# EasyEDA Pro project 硬件部分大作业  大一  徐子涵 学号2025210236.epro, schematic Schematic1
Board Name: Board1; Create Date: 2025-12-03; Page Name: main; Project Name: my_first_ed_1; Schematic Name: Schematic1; Update Date: 2025-12-11; Company: 嘉立创EDA; Page Size: A3; Version: V1.0
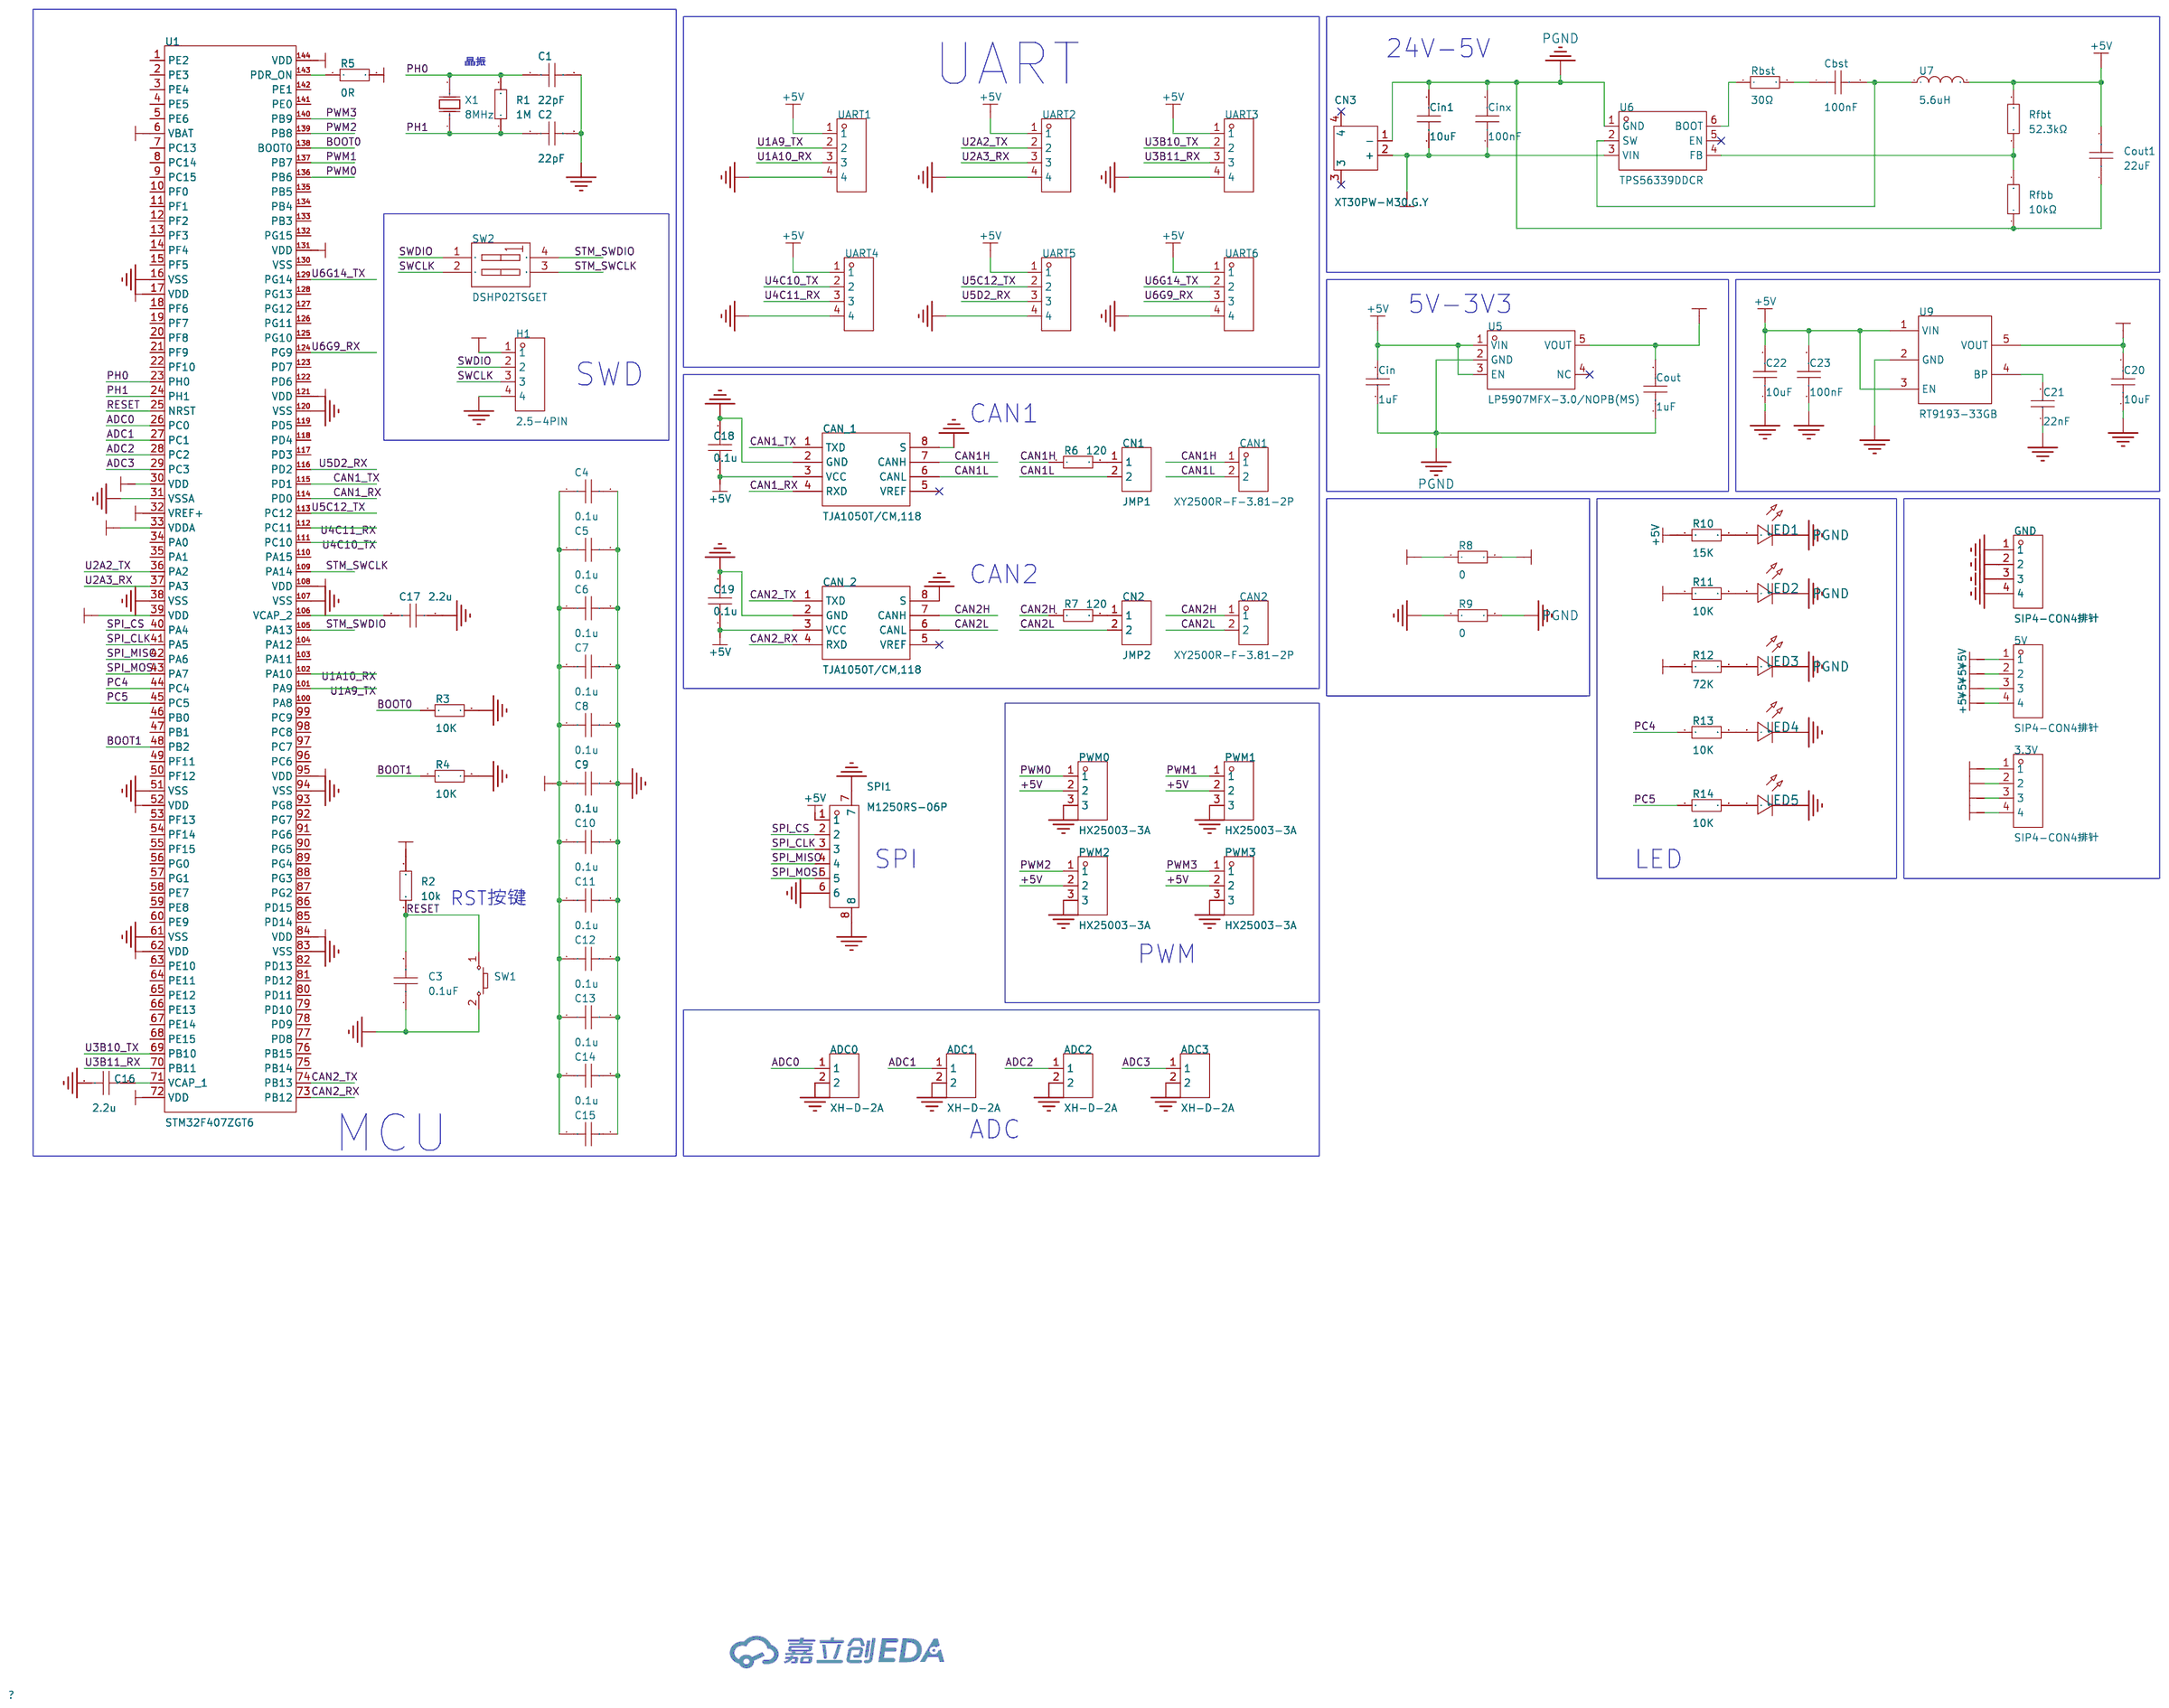
[diagram p0: schematic sheet]

## Parts
3.3V  SIP4-CON4排针  [HDR-TH_4P-P2.54-V-M-3]
5V  SIP4-CON4排针  [HDR-TH_4P-P2.54-V-M-3]
ADC0  XH-D-2A  [CONN-TH_XH-2A]
ADC1  XH-D-2A  [CONN-TH_XH-2A]
ADC2  XH-D-2A  [CONN-TH_XH-2A]
ADC3  XH-D-2A  [CONN-TH_XH-2A]
C1  22pF  [C0603]
C2  22pF  [C0603]
C3  0.1uF  [C0603]
C4  0.1u  [C0402]
C5  0.1u  [C0402]
C6  0.1u  [C0402]
C7  0.1u  [C0402]
C8  0.1u  [C0402]
C9  0.1u  [C0402]
C10  0.1u  [C0402]
C11  0.1u  [C0402]
C12  0.1u  [C0402]
C13  0.1u  [C0402]
C14  0.1u  [C0402]
C15  0.1u  [C0402]
C16  2.2u  [C0603]
C17  2.2u  [C0603]
C18  0.1u  [C0603]
C19  0.1u  [C0603]
C20  10uF  [C0603]
C21  22nF  [C0603]
C22  10uF  [C0603]
C23  100nF  [C0603]
CAN1  XY2500R-F-3.81-2P  [CONN-TH_XY2500R-F-3.81-2P]
CAN2  XY2500R-F-3.81-2P  [CONN-TH_XY2500R-F-3.81-2P]
CAN_1  TJA1050T/CM,118  [SOIC-8_L5.0-W4.0-P1.27-LS6.0-BL]
CAN_2  TJA1050T/CM,118  [SOIC-8_L5.0-W4.0-P1.27-LS6.0-BL]
Cbst  100nF  [C0805]
Cin  1uF  [C0603]
Cin1  10uF  [C0805]
Cinx  100nF  [C0805]
CN1  JMP1  [HDR-TH_2P-P2.54_C9900022687]
CN2  JMP2  [HDR-TH_2P-P2.54_C9900022687]
CN3  XT30PW-M30.G.Y  [CONN-TH_XT30PW-M]
Cout  1uF  [C0402]
Cout1  22uF  [C0805]
GND  SIP4-CON4排针  [HDR-TH_4P-P2.54-V-M-3]
H1  2.5-4PIN  [HDR-TH_4P-P2.54-V-M]
LED1  -  [LED_0603]
LED2  -  [LED_0603]
LED3  -  [LED_0603]
LED4  -  [LED_0603]
LED5  -  [LED_0603]
PWM0  HX25003-3A  [CONN-TH_3P-P2.50_HX25003-3A]
PWM1  HX25003-3A  [CONN-TH_3P-P2.50_HX25003-3A]
PWM2  HX25003-3A  [CONN-TH_3P-P2.50_HX25003-3A]
PWM3  HX25003-3A  [CONN-TH_3P-P2.50_HX25003-3A]
R1  1M  [R0603]
R2  10k  [R0603]
R3  10K  [R0603]
R4  10K  [R0603]
R5  0R  [R0603]
R6  120  [R0603]
R7  120  [R0603]
R8  0  [R0603]
R9  0  [R0603]
R10  15K  [R0603]
R11  10K  [R0603]
R12  72K  [R0603]
R13  10K  [R0603]
R14  10K  [R0603]
Rbst  30Ω  [R0603]
Rfbb  10kΩ  [R0603]
Rfbt  52.3kΩ  [R0603]
SPI1  M1250RS-06P  [CONN-SMD_M1250RS-06P]
SW1  -  [Key_SMD_3x4x2]
SW2  DSHP02TSGET  [SW-SMD_4P_DSHP02TSGET]
U1  STM32F407ZGT6  [LQFP-144_L20.0-W20.0-P0.50-LS22.0-BL]
U5  LP5907MFX-3.0/NOPB(MS)  [SOT-23-5_L2.9-W1.6-P0.95-LS2.8-BR]
U6  TPS56339DDCR  [TSOT-23-6_L2.9-W1.6-P0.95-LS2.8-BR]
U7  5.6uH  [IND-SMD_L13.0-W13.0-SDR1307-XXXXX]
U9  RT9193-33GB  [SOT-23-5_L3.0-W1.7-P0.95-LS2.8-BL]
UART1  SIP4-CON4排针  [HDR-TH_4P-P2.54-V-M-3]
UART2  SIP4-CON4排针  [HDR-TH_4P-P2.54-V-M-3]
UART3  SIP4-CON4排针  [HDR-TH_4P-P2.54-V-M-3]
UART4  SIP4-CON4排针  [HDR-TH_4P-P2.54-V-M-3]
UART5  SIP4-CON4排针  [HDR-TH_4P-P2.54-V-M-3]
UART6  SIP4-CON4排针  [HDR-TH_4P-P2.54-V-M-3]
X1  8MHz  [CRYSTAL-SMD_L5.0-W3.2]

## Library data of the parts
3.3V 5V GND UART1-UART6 = SIP4-CON4排针: Supplier Part: C9900002129; Supplier Footprint: SIP-4_2.54X10.16X2.54P; JLCPCB Part Class: 扩展库; Supplier: LCSC
ADC0-ADC3 = XH-D-2A: 插针结构:1x2P;间距:2.5mm;安装方式:直插;参考系列:XH;总PIN数:2P;排数:1;每排PIN数:2;行距:-;额定电流:3A;触头材质:-;触头镀层:-;工作温度:-25℃~+85℃;; LCSC Part Name: 1x2P 间距:2.5mm 直插 系列:XH; Supplier Part: C5160911; Manufacturer: DEALON(德艺隆); Supplier Footprint: 插件,P=2.5mm; JLCPCB Part Class: 扩展库; Datasheet: https://item.szlcsc.com/datasheet/XH-D-2A/5808077.html; Supplier: LCSC; Pins Structure: 1x2P; Pitch: 2.5mm; Mounting Type: 直插; Reference Series: XH; Number of Pins: 2P; Number of Rows: 1; Number of PINs Per Row: 2; Current Rating: 3A; Operating Temperature: -25℃~+85℃; Voltage Rating: 250V; Color: 白色; Z-Height of the Board: 7mm; X-Length of Bottom Edge on Board (Spacing Line): 7.5mm; Y-Width of Bottom Edge on Board: 5.8mm
C1-C3 C16-C19 = CAP_0603: Supplier Footprint: 0603; Sim Model: eb8db00cf755486a99d82f511adf71ce; Sim Model Title: Capacitor; Sim Model Path: 0819f05c4eef4c71ace90d822a990e87; NGSpice Model: b0400270a9e64a8faba05adf23a90584; NGSpice Model Title: Capacitor; NGspice Model Path: 0819f05c4eef4c71ace90d822a990e87
C4-C15 = CAP_0603: Supplier Footprint: 0402; Sim Model: eb8db00cf755486a99d82f511adf71ce; Sim Model Title: Capacitor; Sim Model Path: 0819f05c4eef4c71ace90d822a990e87; NGSpice Model: b0400270a9e64a8faba05adf23a90584; NGSpice Model Title: Capacitor; NGspice Model Path: 0819f05c4eef4c71ace90d822a990e87
C20 C22 = CGA0603X5R106K100JT: 容值:10uF;精度:±10%;额定电压:10V;温度系数:X5R;; LCSC Part Name: 10uF ±10% 10V; Supplier Part: C6119842; Manufacturer: HRE(芯声); Supplier Footprint: 0603; JLCPCB Part Class: 扩展库; Supplier: LCSC; Tolerance: ±10%; Voltage Rating: 10V; Temperature Coefficient: X5R
C21 = CL10B223KB8NNNC: 容值:22nF;精度:±10%;额定电压:50V;温度系数:X7R;; LCSC Part Name: 22nF ±10% 50V; Supplier Part: C21122; Manufacturer: SAMSUNG(三星); Supplier Footprint: 0603; JLCPCB Part Class: 基础库; Datasheet: https://item.szlcsc.com/datasheet/CL10B223KB8NNNC/21834.html; Supplier: LCSC; Tolerance: ±10%; Voltage Rating: 50V; Temperature Coefficient: X7R
C23 = CGA0603X7R104K500JT: 容值:100nF;精度:±10%;额定电压:50V;温度系数:X7R;; LCSC Part Name: 100nF ±10% 50V; Supplier Part: C6119867; Manufacturer: HRE(芯声); Supplier Footprint: 0603; JLCPCB Part Class: 扩展库; Datasheet: https://atta.szlcsc.com/upload/public/pdf/source/20250103/C44077DA9E7B3EFAE02F22B6D3D1CBC9.pdf; Supplier: LCSC; Tolerance: ±10%; Voltage Rating: 50V; Temperature Coefficient: X7R
CAN1 CAN2 = XY2500R-F-3.81-2P: 连接器类型:板端/插座-闭口;结构:1x2P;间距:3.81mm;颜色:绿色;安装方式:弯针;排数:1;每排PIN数:2;额定电流:8A;额定电压:300V;工作温度:-;; LCSC Part Name: 1x2P 3.81mm 排数:1 每排P数:2; Supplier Part: C880581; Manufacturer: XINLAIYA(新莱亚); Supplier Footprint: 弯插,P=3.81mm; JLCPCB Part Class: 扩展库; Datasheet: https://item.szlcsc.com/datasheet/XY2500R-F-3.81-2P/943405.html; Supplier: LCSC; Connector Type: 板端/插座-闭口; Number of Positions or Pins: 1x2P; Pitch: 3.81mm; Color: 绿色; Mounting Type: 弯针; Number of Pins: 2P; Number of Rows: 1; Number of PINs Per Row: 2; Current Rating: 8A; Voltage Rating (Max): 300V
CAN_1 CAN_2 = TJA1050T/CM,118: 类型:-;; LCSC Part Name: 4.75V~5.25V; Supplier Part: C6952; Manufacturer: NXP(恩智浦); Supplier Footprint: SOP-8; JLCPCB Part Class: 扩展库; Datasheet: https://www.nxp.com/docs/en/data-sheet/TJA1050.pdf; Supplier: LCSC; Supply Voltage: 4.75V~5.25V; Supply Current: 50mA
Cbst Cinx = C0805C104M5RACTU: 容值:100nF;精度:±20%;额定电压:50V;材质(温度系数):X7R;; LCSC Part Name: 100nF ±20% 50V; Supplier Part: C2167099; Manufacturer: KEMET(基美); Supplier Footprint: 0805; JLCPCB Part Class: 扩展库; Datasheet: https://atta.szlcsc.com/upload/public/pdf/source/20210401/FA43491E9CEFD02B2522131A2AAB865C.pdf; Supplier: LCSC; Tolerance: ±20%; Voltage Rated: 50V; Temperature Coefficient: X7R
Cin = EMK107B7105KA-T: 容值:1uF;精度:±10%;额定电压:16V;温度系数:X7R;; LCSC Part Name: MSASE168SB7105KTNA01 1uF ±10% 16V; Supplier Part: C92759; Manufacturer: TAIYO YUDEN(太诱); Supplier Footprint: 0603; JLCPCB Part Class: 扩展库; Datasheet: https://item.szlcsc.com/datasheet/EMK107B7105KA-T/93953.html; Supplier: LCSC; Tolerance: ±10%; Voltage Rating: 16V; Temperature Coefficient: X7R
Cin1 = MSAST21GBB5106MTNA01: 容值:10uF;精度:±20%;额定电压:25V;温度系数:X5R;; LCSC Part Name: TMK212BBJ106MG-T 10uF ±20% 25V; Supplier Part: C7001756; Manufacturer: TAIYO YUDEN(太诱); Supplier Footprint: 0805; JLCPCB Part Class: Extended Part; Datasheet: https://item.szlcsc.com/datasheet/MSAST21GBB5106MTNA01/7967800.html; Supplier: LCSC; Tolerance: ±20%; Voltage Rating: 25V; Temperature Coefficient: X5R
CN1 CN2 = 2.54mm间距 针长19mm 2P排针: Supplier Part: C9900022687; Supplier Footprint: HDR1X2; JLCPCB Part Class: 扩展库; Supplier: LCSC
CN3 = XT30PW-M30.G.Y: 类别:-;类型1:-;; LCSC Part Name: AMASS(艾迈斯)航模插头 卧式弯脚 XT30PW-M公头; Supplier Part: C431092; Manufacturer: AMASS(艾迈斯); JLCPCB Part Class: 扩展库; Datasheet: https://item.szlcsc.com/datasheet/XT30PW-M30.G.Y/426930.html; Supplier: LCSC; Type: 航模插头; RatedVoltage: DC 500V; InterfaceType: 公头; RatedCurrent: 15A; RecommendedWireGauge: 16/18/20AWG; contact resistance: 1.2mΩ; specifications: 2pin
Cout = C1005X5R1E105K050BC: 容值:1uF;精度:±10%;额定电压:25V;温度系数:X5R;; LCSC Part Name: 1uF ±10% 25V; Supplier Part: C2182550; Manufacturer: TDK; Supplier Footprint: 0402; JLCPCB Part Class: 扩展库; Datasheet: https://item.szlcsc.com/datasheet/C1005X5R1E105K050BC/2274617.html; Supplier: LCSC; Tolerance: ±10%; Voltage Rating: 25V; Temperature Coefficient: X5R
Cout1 = C2012X5R1A226M125AB_C2167626: 容值:22uF;精度:±20%;额定电压:10V;温度系数:X5R;; LCSC Part Name: 22uF ±20% 10V; Supplier Part: C2167626; Manufacturer: TDK; Manufacturer Part: C2012X5R1A226M125AB; Supplier Footprint: 0805; JLCPCB Part Class: 扩展库; Datasheet: https://item.szlcsc.com/datasheet/C2012X5R1A226M125AB/2259678.html; Supplier: LCSC; Tolerance: ±20%; Voltage Rating: 10V; Temperature Coefficient: X5R
H1 = 2.5-4PIN: Supplier Part: C9900026893; Supplier Footprint: SWD; JLCPCB Part Class: 扩展库; Supplier: LCSC
LED1-LED5 = LED_0603-R: Supplier Footprint: 0603
PWM0-PWM3 = HX25003-3A: 插针结构:1x3P;间距:2.5mm;安装方式:直插;参考系列:XH;总PIN数:3P;排数:1;每排PIN数:3;行距:-;额定电流:5A;触头材质:黄铜;工作温度:-25℃~+85℃;; LCSC Part Name: 1x3P 间距:2.5mm 直插 系列:XH; Supplier Part: C442300; Manufacturer: HX(红星); Supplier Footprint: 插件,P=2.5mm; JLCPCB Part Class: 扩展库; Datasheet: https://item.szlcsc.com/datasheet/HX25003-3A/442532.html; Supplier: LCSC; Pins Structure: 1x3P; Pitch: 2.5mm; Mounting Type: 直插; Reference Series: XH; Number of Pins: 3P; Number of Rows: 1; Number of PINs Per Row: 3; Current Rating: 5A; Contact Material: 黄铜; Operating Temperature: -25℃~+85℃; Voltage Rating: 250V; Plastic Material: PA; Color: 白色; Z-Height of the Board: 5.9mm; Y-Width of Bottom Edge on Board: 7.2mm
R1-R14 = Res_0603: Supplier Footprint: 0603; Sim Model: 8be60972bfca48309599b114ee1ccaf4; Sim Model Title: Resistor; Sim Model Path: 0819f05c4eef4c71ace90d822a990e87; NGSpice Model: 169a2b7a081142ae9cb8aebabf32e595; NGSpice Model Title: Resistor; NGspice Model Path: 0819f05c4eef4c71ace90d822a990e87
Rbst = RC0603FR-0730RL: 电阻类型:厚膜电阻;阻值:30Ω;精度:±1%;功率:100mW;工作电压:75V;温度系数:±100ppm/℃;; LCSC Part Name: 厚膜电阻 30Ω ±1% 100mW; Supplier Part: C128060; Manufacturer: YAGEO(国巨); Supplier Footprint: 0603; JLCPCB Part Class: 扩展库; Datasheet: https://item.szlcsc.com/datasheet/RC0603FR-0730RL/139345.html; Supplier: LCSC; Type: 厚膜电阻; Tolerance: ±1%; Power(Watts): 100mW; Voltage-Supply(Max): 75V; Temperature Coefficient: ±100ppm/℃; Operating Temperature: -55℃~+155℃
Rfbb = RC0603FR-0710KL: 电阻类型:厚膜电阻;阻值:10kΩ;精度:±1%;功率:100mW;最大工作电压:75V;温度系数:±100ppm/℃;; LCSC Part Name: 厚膜电阻 10kΩ ±1% 100mW; Supplier Part: C98220; Manufacturer: YAGEO(国巨); Supplier Footprint: 0603; JLCPCB Part Class: 扩展库; Datasheet: https://atta.szlcsc.com/upload/public/pdf/source/20180927/C295883_E8D83085EA81BD7DE0B2B681138C15EE.pdf; Supplier: LCSC; Type: 厚膜电阻; Tolerance: ±1%; Power(Watts): 100mW; Overload Voltage (Max): 75V; Temperature Coefficient: ±100ppm/℃; Operating Temperature Range: -55℃~+155℃
Rfbt = RC0603FR-0752K3L: 电阻类型:厚膜电阻;阻值:52.3kΩ;精度:±1%;功率:100mW;工作电压:75V;温度系数:±100ppm/℃;; LCSC Part Name: 厚膜电阻 52.3kΩ ±1% 100mW; Supplier Part: C185323; Manufacturer: YAGEO(国巨); Supplier Footprint: 0603; JLCPCB Part Class: 扩展库; Datasheet: https://item.szlcsc.com/datasheet/RC0603FR-0752K3L/196728.html; Supplier: LCSC; Type: 厚膜电阻; Tolerance: ±1%; Power(Watts): 100mW; Voltage-Supply(Max): 75V; Temperature Coefficient: ±100ppm/℃; Operating Temperature: -55℃~+155℃
SPI1 = M1250RS-06P: 插针结构:1x6P;间距:1.25mm;安装方式:卧贴;参考系列:-;总PIN数:6P;排数:1;每排PIN数:6;行距:-;额定电流:1A;工作温度:-25℃~+85℃;; LCSC Part Name: 1x6P 间距:1.25mm 卧贴; Supplier Part: C705227; Manufacturer: XFCN(兴飞); Supplier Footprint: SMD,P=1.25mm,卧贴; JLCPCB Part Class: 扩展库; Datasheet: https://item.szlcsc.com/datasheet/M1250RS-06P/741384.html; Supplier: LCSC; Pins Structure: 1x6P; Pitch: 1.25mm; Mounting Type: 卧贴; Number of Pins: 6P; Number of Rows: 1; Number of PINs Per Row: 6; Current Rating: 1A; Operating Temperature: -25℃~+85℃; Voltage Rating: 125V; Z-Height of the Board: 3.7mm; Y-Width of Bottom Edge on Board: 5.25mm
SW1 = Key_SMD_3x4x2: Supplier Footprint: SMD
SW2 = DSHP02TSGET: 类型:平拨,凹槽式;电路结构:单刀单掷;开关位数:2位;工作寿命:-;颜色:黑色;; LCSC Part Name: 2位 1.27间距; Supplier Part: C40735; Manufacturer: YE; Supplier Footprint: SMD-4P,5.4x4.1mm; JLCPCB Part Class: 扩展库; Datasheet: https://item.szlcsc.com/datasheet/DSHP02TSGET/41719.html; Supplier: LCSC; Type: 平拨,凹槽式; Circuit: 单刀单掷; Number of Positions: 2位; Lead Pitch: 1.27mm; Color: 黑色
